# EAGLE schematic First Draft (EAGLE 6.4)
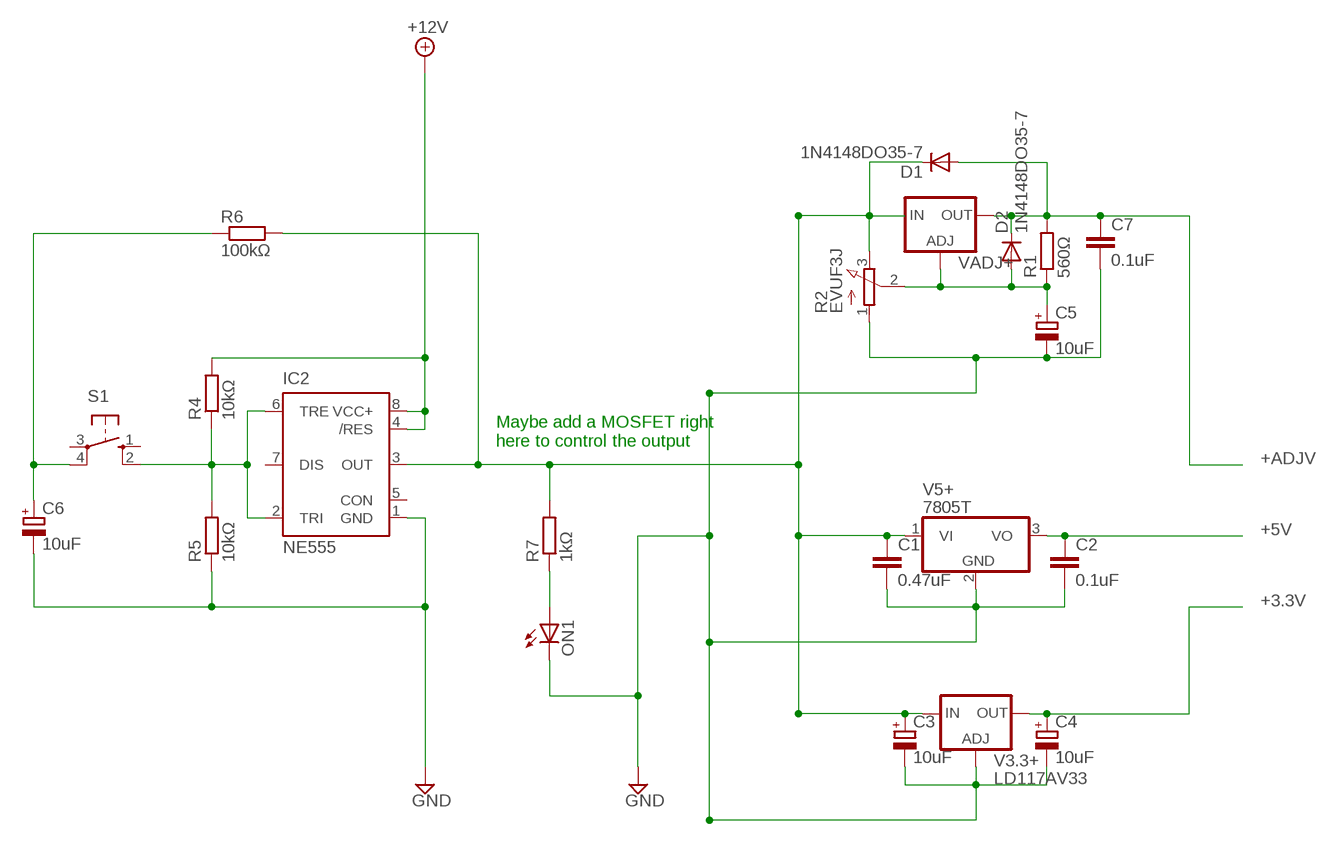
[diagram p0: schematic, sheet 1]

## Parts
C1  0.47uF  C-EU025-025X050  [C025-025X050]
C2  0.1uF  C-EU025-025X050  [C025-025X050]
C3  10uF  CPOL-EUE2.5-6  [E2,5-6]
C4  10uF  CPOL-EUE2.5-6  [E2,5-6]
C5  10uF  CPOL-EUE2.5-6  [E2,5-6]
C6  10uF  CPOL-EUE2.5-6  [E2,5-6]
C7  0.1uF  C-EU025-025X050  [C025-025X050]
D1  1N4148DO35-7  [DO35-7]
D2  1N4148DO35-7  [DO35-7]
IC2  NE555  [DIL-08]
ON1  LED3MM  [LED3MM]
R1  560Ω  R-EU_0207/10  [0207/10]
R2  EVUF3J  [EVUFXJ]
R4  10kΩ  R-EU_0207/10  [0207/10]
R5  10kΩ  R-EU_0207/10  [0207/10]
R6  100kΩ  R-EU_0207/10  [0207/10]
R7  1kΩ  R-EU_0207/10  [0207/10]
S1  10-XX  [B3F-10XX]
V3.3+  LD117AV33  [TO220L1]
V5+  7805T  [TO220H]
VADJ+  LM317TL  [317TL]

## Nets
+3.3V: C4.+ V3.3+.2(OUT)
+5V: C2.1 V5+.3(VO)
+12V: IC2.4(/RES) IC2.8(VCC+) R4.2
+ADJV: C7.1 D1.A D2.C R1.2 VADJ+.2(OUT)
GND: C1.2 C2.2 C3.- C4.- C5.- C6.- C7.2 IC2.1(GND) ON1.K(C) R2.1(A) R5.1 V3.3+.1(ADJ) V5+.2(GND)
N$1: IC2.2(TRI) IC2.6(TRE) R4.1 R5.2 S1.2(S1)
N$2: C6.+ R6.1 S1.4(P1)
N$3: ON1.A R7.1
N$8: C5.+ D2.A R1.1 R2.2(S) VADJ+.1(ADJ)
VIN: C1.1 C3.+ D1.C IC2.3(OUT) R2.3(E) R6.2 R7.2 V3.3+.3(IN) V5+.1(VI) VADJ+.3(IN)
Unconnected: IC2.5(CON) IC2.7(DIS) S1.1(S) S1.3(P)

## Notes on the sheet
- Maybe add a MOSFET right
  here to control the output

## Library data of the parts
C1 C2 C7 = rcl:C-EU: CAPACITOR, European symbol
C3-C6 = rcl:CPOL-EU: POLARIZED CAPACITOR, European symbol
D1 D2 = diode:1N4148: DIODE high speed (Philips)
IC2 = st-microelectronics:NE555: General purpose bipolar Timer; MF: Arrow Electronics; MPN: NE555N; OC_FARNELL: 1467742; OC_NEWARK: 89K1486
ON1 = led:LED: LED OSRAM: - CHIPLED LG R971, LG N971, LY N971, LG Q971, LY Q971, LO R971, LY R971 LH N974, LH R974 LS Q976, LO Q976, LY Q976 LO Q996 - Hyper CHIPLED LW Q18S LB Q993, LB Q99A, LB R99A - SideLED LS A670, LO A670, LY A670, LG A670, LP A670 LB A673, LV A673, LT A673, LW A673 LH A674 LY A675 LS A676, LA A676, LO A676, LY A676, LW A676 LS A679, LY A679, LG A679 - Hyper Micro SIDELED® LS Y876, LA Y876, LO Y876, LY Y876 LT Y87S - SmartLED LW L88C, LW L88S LB L89C, LB L89S, LG L890 LS L89K, LO L89K, LY L89K LS L896, LA L896, LO L896, LY L896 - TOPLED LS T670, LO T670, LY T670, LG T670, LP T670 LSG T670, LSP T670, LSY T670, LOP T670, LYG T670 LG T671, LOG T671, LSG T671 LB T673, LV T673, LT T673, LW T673 LH T674 LS T676, LA T676, LO T676, LY T676, LB T676, LH T676, LSB T676, LW T676 LB T67C, LV T67C, LT T67C, LS T67K, LO T67K, LY T67K, LW E67C LS E67B, LA E67B, LO E67B, LY E67B, LB E67C, LV E67C, LT E67C LW T67C LS T679, LY T679, LG T679 LS T770, LO T770, LY T770, LG T770, LP T770 LB T773, LV T773, LT T773, LW T773 LH T774 LS E675, LA E675, LY E675, LS T675 LS T776, LA T776, LO T776, LY T776, LB T776 LHGB T686 LT T68C, LB T68C - Hyper Mini TOPLED® LB M676 - Mini TOPLED Santana® LG M470 LS M47K, LO M47K, LY M47K Source: http://www.osram.convergy.de LUXEON: - LUMILED® LXK2-PW12-R00, LXK2-PW12-S00, LXK2-PW14-U00, LXK2-PW14-V00 LXK2-PM12-R00, LXK2-PM12-S00, LXK2-PM14-U00 LXK2-PE12-Q00, LXK2-PE12-R00, LXK2-PE12-S00, LXK2-PE14-T00, LXK2-PE14-U00 LXK2-PB12-K00, LXK2-PB12-L00, LXK2-PB12-M00, LXK2-PB14-N00, LXK2-PB14-P00, LXK2-PB14-Q00 LXK2-PR12-L00, LXK2-PR12-M00, LXK2-PR14-Q00, LXK2-PR14-R00 LXK2-PD12-Q00, LXK2-PD12-R00, LXK2-PD12-S00 LXK2-PH12-R00, LXK2-PH12-S00 LXK2-PL12-P00, LXK2-PL12-Q00, LXK2-PL12-R00 Source: www.luxeon.com KINGBRIGHT: KA-3528ASYC Source: www.kingbright.com
R1 = resistor:R-EU_: RESISTOR, European symbol
R2 = pot:EVU: 9 mm Square Rotary Potentiometers Source: Panasonic
R4-R7 = rcl:R-EU_: RESISTOR, European symbol
S1 = switch-omron:10-XX: OMRON SWITCH; MPN: B3F-1000; OC_FARNELL: 176432; OC_NEWARK: 36M3542
V3.3+ = v-reg:LD117A?*: Low drop fixed and adjustable positive voltage regulators 1 A Source: http://www.st.com/stonline/products/literature/ds/7194/ld1117axx.pdf
V5+ = linear:78*: Positive VOLTAGE REGULATOR Source: http://cache.national.com/ds/LM/LM78L05.pdf http://www.fairchildsemi.com/ds/LM/LM7805.pdf
VADJ+ = v-reg:LM317TL: VOLTAGE REGULATOR